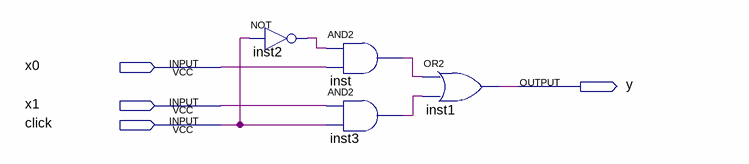
[diagram p0: schematic sheet]
// Quartus schematic multiplexer.bdf as structural Verilog: 4 symbols, 4 pins
module multiplexer (
  input  x0,
  input  x1,
  input  click,
  output y
);

  wire inst2_out, inst3_out, inst_out;

  not inst2 (inst2_out, click);
  and inst (inst_out, inst2_out, x0);
  and inst3 (inst3_out, x1, click);
  or inst1 (y, inst_out, inst3_out);
endmodule
